# Altium schematic sheet 200_AUX_SUPPLIES.SchDoc
size A3; SheetNumber: 3; SheetTotal: 5
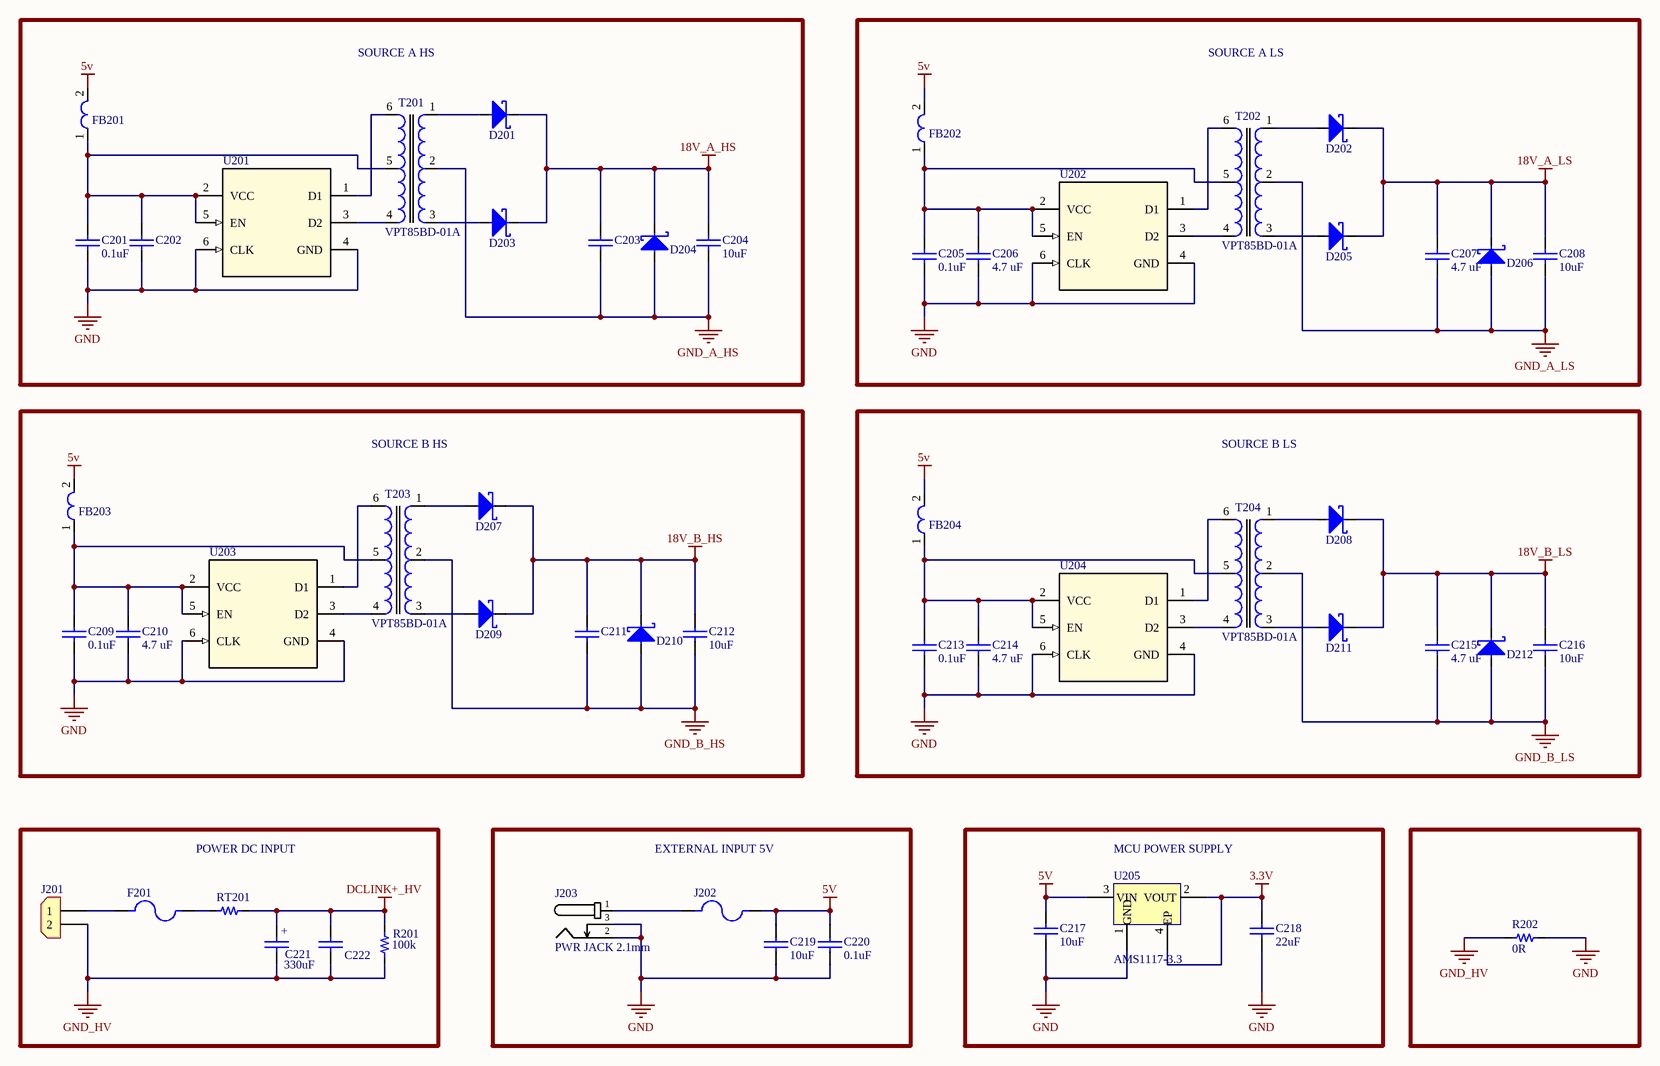
[diagram p0: 200_AUX_SUPPLIES.SchDoc]

## Parts
C201  value 0.1uF  [0603_cap]
C202  (no value)  [0603_cap]
C203  (no value)  [0603_cap]
C204  value 10uF  [0805_cap]
C205  value 0.1uF  [0603_cap]
C206  4.7 uF  [0603_cap]
C207  4.7 uF  [0603_cap]
C208  value 10uF  [0805_cap]
C209  value 0.1uF  [0603_cap]
C210  4.7 uF  [0603_cap]
C211  (no value)  [0603_cap]
C212  value 10uF  [0805_cap]
C213  value 0.1uF  [0603_cap]
C214  4.7 uF  [0603_cap]
C215  4.7 uF  [0603_cap]
C216  value 10uF  [0805_cap]
C217  value 10uF  [0603_cap]  (hidden comment: 10uF 10V)
C218  value 22uF  [0603_cap]  (hidden comment: 22uF 10V)
C219  value 10uF  [0805_cap]  (hidden comment: 10uF 25V)
C220  0.1uF  [0603_cap]
C221  value 330uF  [CAP_MXC_22x30_RUB]
C222  (no value)  [CAP_M26.5X8.5_22.5_1_KEM]
D201  30V 3A  [SMA]  (value not drawn)
D202  30V 3A  [SMA]  (value not drawn)
D203  30V 3A  [SMA]  (value not drawn)
D204  Diodo - Zener 20 V  [SOD-123_ONS]  (value not drawn)
D205  30V 3A  [SMA]  (value not drawn)
D206  Diodo - Zener 20 V  [SOD-123_ONS]  (value not drawn)
D207  30V 3A  [SMA]  (value not drawn)
D208  30V 3A  [SMA]  (value not drawn)
D209  30V 3A  [SMA]  (value not drawn)
D210  Diodo - Zener 20 V  [SOD-123_ONS]  (value not drawn)
D211  30V 3A  [SMA]  (value not drawn)
D212  Diodo - Zener 20 V  [SOD-123_ONS]  (value not drawn)
F201  (no value)  [FUSE_4628]
FB201  (no value)  [MH1608]
FB202  FERRITE_BEAD_600_OHM  [MH1608]  (value not drawn)
FB203  (no value)  [MH1608]
FB204  (no value)  [MH1608]
J201  (no value)  [CON_2x1_TH_5MM]
J202  FUSE HLDR CARTRIDGE 250V 5A PCB  [FUSE_4628]  (value not drawn)
J203  PWR JACK 2.1mm  [CON_POWER_BARREL_2.1MM_3CONN]
R201  value 100k  [YAG_FMP200_YAG]
R202  value 0R  [0603_res]  (hidden comment: 0R 1/10W)
RT201  (no value)  [RES_37S509M_TDK]
T201  Manufacturer Part Number: VPT85BD-01A  [PAD002-T764113S]  (hidden comment: TRANSFORMER_SMPS_XFMR_FWD)
T202  Manufacturer Part Number: VPT85BD-01A  [PAD002-T764113S]  (hidden comment: TRANSFORMER_SMPS_XFMR_FWD)
T203  Manufacturer Part Number: VPT85BD-01A  [PAD002-T764113S]  (hidden comment: TRANSFORMER_SMPS_XFMR_FWD)
T204  Manufacturer Part Number: VPT85BD-01A  [PAD002-T764113S]  (hidden comment: TRANSFORMER_SMPS_XFMR_FWD)
U201  (no value)  [IC TRANSFORMER DRIVER 6SOT-23]
U202  (no value)  [IC TRANSFORMER DRIVER 6SOT-23]
U203  (no value)  [IC TRANSFORMER DRIVER 6SOT-23]
U204  (no value)  [IC TRANSFORMER DRIVER 6SOT-23]
U205  AMS1117-3.3  [SOT_223]

## Blocks framed on the sheet
SOURCE A HS: C201-C204 D201 D203 D204 FB201 T201 U201
SOURCE A LS: C205-C208 D202 D205 D206 FB202 T202 U202
SOURCE B HS: C209-C212 D207 D209 D210 FB203 T203 U203
SOURCE B LS: C213-C216 D208 D211 D212 FB204 T204 U204
POWER DC INPUT: C221 C222 F201 J201 R201 RT201
EXTERNAL INPUT 5V: C219 C220 J202 J203
MCU POWER SUPPLY: C217 C218 U205

## Nets
3.3V: C218.1 U205.2(VOUT) U205.4(EP)
5v: C217.1 C219.1 C220.1 FB201.2 FB202.2 FB203.2 FB204.2 J202.2 U205.3(VIN)
18V_A_HS: C203.1 C204.1 D201.1 D203.1 D204.1
18V_A_LS: C207.1 C208.1 D202.1 D205.1 D206.1
18V_B_HS: C211.1 C212.1 D207.1 D209.1 D210.1
18V_B_LS: C215.1 C216.1 D208.1 D211.1 D212.1
DCLINK+_HV: C221.1 C222.1 R201.2 RT201.2
GND: C201.2 C202.2 C205.2 C206.2 C209.2 C210.2 C213.2 C214.2 C217.2 C218.2 C219.2 C220.2 J203.2 J203.3 R202.2 U201.4(GND) U201.6(CLK) U202.4(GND) U202.6(CLK) U203.4(GND) U203.6(CLK) U204.4(GND) U204.6(CLK) U205.1(GND)
GND_A_HS: C203.2 C204.2 D204.2 T201.2
GND_A_LS: C207.2 C208.2 D206.2 T202.2
GND_B_HS: C211.2 C212.2 D210.2 T203.2
GND_B_LS: C215.2 C216.2 D212.2 T204.2
GND_HV: C221.2 C222.2 J201.2 R201.1 R202.1
NetC201_1: C201.1 C202.1 FB201.1 T201.5 U201.2(VCC) U201.5(EN)
NetC205_1: C205.1 C206.1 FB202.1 T202.5 U202.2(VCC) U202.5(EN)
NetC209_1: C209.1 C210.1 FB203.1 T203.5 U203.2(VCC) U203.5(EN)
NetC213_1: C213.1 C214.1 FB204.1 T204.5 U204.2(VCC) U204.5(EN)
NetD201_2: D201.2 T201.1
NetD202_2: D202.2 T202.1
NetD203_2: D203.2 T201.3
NetD205_2: D205.2 T202.3
NetD207_2: D207.2 T203.1
NetD208_2: D208.2 T204.1
NetD209_2: D209.2 T203.3
NetD211_2: D211.2 T204.3
NetF201_1: F201.1 J201.1
NetF201_2: F201.2 RT201.1
NetJ202_1: J202.1 J203.1
NetT201_4: T201.4 U201.3(D2)
NetT201_6: T201.6 U201.1(D1)
NetT202_4: T202.4 U202.3(D2)
NetT202_6: T202.6 U202.1(D1)
NetT203_4: T203.4 U203.3(D2)
NetT203_6: T203.6 U203.1(D1)
NetT204_4: T204.4 U204.3(D2)
NetT204_6: T204.6 U204.1(D1)

## Notes on the sheet
- (in symbol CAP_ALUM_330UF_250V) +

## Library data of the parts
C201 C205 C209 C213 = Cap_0.1uF_0603_50V: 50V 100nF Y5V -20%~+80% 0603 Multilayer Ceramic Capacitors MLCC - SMD/SMT ROHS; Manufacturer: Walsin Tech Corp; Manufacturer Part Number: 0603F104Z500CT; Supplier 1: LCSC; Supplier Part Number 1: C83060; ComponentLink1Description: LCSC; ComponentLink1URL: https://www.lcsc.com/product-detail/Multilayer-Ceramic-Capacitors-MLCC-SMD-SMT_Walsin-Tech-Corp-0603F104Z500CT_C83060.html
C202 C203 C206 C207 C210 C211 C214 C215 = CAP_4.7UF_25V_0603: CAP CER 4.7uF 25V X5R 0603; Manufacturer: muRata; Manufacturer Part Number: GRM188R61E475KE11D; ComponentLink1Description: LCSC; ComponentLink1URL: https://www.lcsc.com/product-detail/C90057.html?s_z=n_q_GRM188R61E475KE11D&spm=wm.fly.bg.0.stp&lcsc_vid=RQNdVwAEE1JbUldTTgAIXlFWQ1NYXlYETgNXUlBVFQMxVlNRTlVXX11TRlZZXjsOAxUeFF5JWBYZEEoKFBINSQcJGk4%3D; Supplier 1: LCSC; Supplier Part Number 1: C90057
C204 C208 C212 C216 C219 = Cap_10uF_0805_25V_: 25V 10uF X5R ±10% 0805 Multilayer Ceramic Capacitors MLCC - SMD/SMT ROHS; Manufacturer: Samsung Electro-Mechanics; Manufacturer Part Number: CL21A106KAYNNNE; Supplier 1: LCSC; Supplier Part Number 1: C15850; ComponentLink1Description: LCSC; ComponentLink1URL: https://lcsc.com/product-detail/Multilayer-Ceramic-Capacitors-MLCC-SMD-SMT_Samsung-Electro-Mechanics-CL21A106KAYNNNE_C15850.html
C217 = Cap_10uF_0603_10V: 10V 10uF X5R ±10% 0603 Multilayer Ceramic Capacitors MLCC - SMD/SMT ROHS; Manufacturer: CCTC; Manufacturer Part Number: TCC0603X5R106K100CT; Supplier 1: LCSC; Supplier Part Number 1: C380314; ComponentLink1Description: LCSC; ComponentLink1URL: https://www.lcsc.com/product-detail/Multilayer-Ceramic-Capacitors-MLCC-SMD-SMT_CCTC-TCC0603X5R106K100CT_C380314.html
C218 = Cap_22uF_0603_10V: 10V 22uF X5R ±20% 0603 Multilayer Ceramic Capacitors MLCC - SMD/SMT ROHS; Manufacturer: HRE; Manufacturer Part Number: CGA0603X5R226M100JT; Supplier 1: LCSC; Supplier Part Number 1: C6119863; ComponentLink1Description: LCSC; ComponentLink1URL: https://lcsc.com/product-detail/Multilayer-Ceramic-Capacitors-MLCC-SMD-SMT_HRE-CGA0603X5R226M100JT_C6119863.html
C220 = Cap_0.1uF_0603_50V: CAP CER 100nF 50V Y5V 0603; Manufacturer: FOJAN; Manufacturer Part Number: FCC0603F104Z500CT; Supplier 1: LCSC; Supplier Part Number 1: C5137469; ComponentLink1Description: LCSC; ComponentLink1URL: https://www.lcsc.com/product-detail/C5137469.html?s_z=n_q_0603F104Z500CT&spm=wm.fly.bg.2.xh&lcsc_vid=Q1QLUFRRTgRfUVdSQAVWUgVQT1JdUlwFE1MMV1EEQgAxVlNRTlhfUFBXRlRXUTsOAxUeFF5JWBYZEEoKFBINSQcJGk4eFQsCAgIaSgADAwAHC0slTldfUldfWQkaCgg%3D; Value: 0.1uF
C221 = CAP_ALUM_330UF_250V: 330 µF 250 V Aluminum Electrolytic Capacitors Radial, Can - Snap-In 3000 Hrs @ 105°C; Manufacturer: Rubycon; Manufacturer Part Number: 250MXG330MEFCSN22X30; Supplier 1: LCSC; Supplier Part Number 1: C239294; ComponentLink1Description: LCSC; ComponentLink1URL: https://www.lcsc.com/product-detail/C239294.html?s_z=n_q_250MXG330MEFCSN22X30
C222 = CAP FILM 1UF 10% 400VDC RADIAL: 1 µF Film Capacitor 200V 400V Polyester, Polyethylene Terephthalate (PET), Metallized Radial; Manufacturer: KEMET; Manufacturer Part Number: R60MN4100AA40K; Supplier 1: LCSC; Supplier Part Number 1: C3775208; ComponentLink1Description: LCSC; ComponentLink1URL: https://www.lcsc.com/product-detail/C3775208.html?s_z=n_q_R60MN4100AA40K&spm=wm.fly.bg.0.xh&lcsc_vid=Q1QLUFRRTgRfUVdSQAVWUgVQT1JdUlwFE1MMV1EEQgAxVlNRTlZbUlJXT1VWXjsOAxUeFF5JWBYZEEoKFBINSQcJGk4eFQsCAgIaSgADAwAHC0slRVhXUFVQR08GEwkK
D201-D203 D205 D207-D209 D211 = D_Schottky_40V_3A_SMA: 40V Independent 3A 550mV@3A SMA Schottky Diodes ROHS; Manufacturer: TDSEMIC; Manufacturer Part Number: SS34-TD; Supplier 1: LCSC; Supplier Part Number 1: C46550832; ComponentLink1Description: LCSC; ComponentLink1URL: https://lcsc.com/product-detail/Schottky-Diodes_TDSEMIC-SS34-TD_C46550832.html
D204 D206 D210 D212 = Diodo - Zener 20 V: -55℃~+150℃ 1 Independent 100nA@15V 19V~21V 20V 25Ω 500mW 600Ω SOD-123 Zener Diodes ROHS; Manufacturer: Slkor(SLKORMICRO Elec.); Manufacturer Part Number: MMSZ5250B; Supplier 1: JLCPCB; Supplier Part Number 1: C707177; ComponentLink1Description: JLCPCB; ComponentLink1URL: https://jlcpcb.com/partdetail/Slkor_SLKORMICRO_Elec-MMSZ5250B/C707177
F201 J202 = FUSE HLDR CARTRIDGE 250V 5A PCB: Fuse Holder 5 A 250V 1 Circuit Cartridge Through Hole; Manufacturer: Keystone; Manufacturer Part Number: 4628; Supplier 1: LCSC; Supplier Part Number 1: C3205254; ComponentLink1Description: LCSC; ComponentLink1URL: https://www.lcsc.com/product-detail/C3205254.html?s_z=n_q_x_Keystone%25204628&spm=wm.ssy.em.0.tz&lcsc_vid=Q1QLUFRRTgRfUVdSQAVWUgVQT1JdUlwFE1MMV1EEQgAxVlNRTlZbVlFQQVlcXzsOAxUeFF5JWBYZEEoKFBINSQcJGk4eFQsCAgIaSgADAwAHC0slQ1hXVFRQQU8GEwkK
FB201-FB204 = FERRITE_BEAD_600_OHM: FERRITE BEAD 600 OHM 0603 4LN; Manufacturer: Bourns Inc.; Manufacturer Part Number: MH1608-601Y; ComponentLink1Description: DigiKEy; ComponentLink1URL: https://www.digikey.com/en/products/detail/bourns-inc/MH1608-601Y/2563317; Supplier 1: DigiKey; Supplier Part Number 1: MH1608-601YCT-ND
J201 = Con_2x1_TH_5mm: 2POS 5MM; Manufacturer: JILN; Manufacturer Part Number: JL126-50002G01; Supplier 1: LCSC; Supplier Part Number 1: C394556; ComponentLink1Description: Digi-Key; ComponentLink1URL: https://www.lcsc.com/product-detail/Screw-terminal_JILN-JL126-50002G01_C394556.html
J203 = Con_Power_Jack_2.1mm_3pins: CONN PWR JACK 2X5.5MM SOLDER; Manufacturer: HCTL; Manufacturer Part Number: HC-DC-005-2.0T; Supplier 1: LCSC; Supplier Part Number 1: C3010533; ComponentLink1Description: LCSC; ComponentLink1URL: https://www.lcsc.com/product-detail/AC-DC-Power-Connectors_HCTL-HC-DC-005-2-0T_C3010533.html
R201 = RES 100K OHM 5% 2W AXIAL: 100 kOhms ±5% 2W Through Hole Resistor Axial Flame Proof, Safety Metal Film; Manufacturer: YAGEO; Manufacturer Part Number: FMP200JR-52-100K; ComponentLink1URL: https://www.lcsc.com/product-detail/C3456483.html?s_z=n_q_FMP200JR-52-100K&spm=wm.fly.bg.0.xh&lcsc_vid=Q1QLUFRRTgRfUVdSQAVWUgVQT1JdUlwFE1MMV1EEQgAxVlNRTlZbUVVUQFBeVjsOAxUeFF5JWBYZEEoKFBINSQcJGk4eFQsCAgIaSgADAwAHC0slRFZZUlZWT08GEwkK; Supplier 1: LCSC; Supplier Part Number 1: C3456483; ComponentLink1Description: LCSC
R202 = Res_0R_0603_1/10W: RES SMD 0R OHM 5% 1/10W 0603; Manufacturer: FOJAN; Manufacturer Part Number: FRC0603P000 TS; ComponentLink1URL: https://www.lcsc.com/product-detail/Chip-Resistor-Surface-Mount_FOJAN-FRC0603P000-TS_C2907080.html; Supplier 1: LCSC; Supplier Part Number 1: C2907080; ComponentLink1Description: LCSC
RT201 = ICL_5_OHM_5A: Inrush Current Limiter 5 Ohms ±20% 5 A 0.591" (15.00mm); Manufacturer: TDK; Manufacturer Part Number: B57237S0509M000; ComponentLink1URL: https://www.lcsc.com/product-detail/C718537.html?s_z=n_q_B57237S0509M000&spm=wm.fly.bg.0.xh&lcsc_vid=FQVeX1BfQFIKVFVWE1NbBlcHQlcKVgFUQwMPAQZWElcxVlNRTlldUVVTT1FbVjsOAxUeFF5JWBYZEEoKFBINSQcJGk4eFQsCAgIaSgADAwAHC0slRFVbUVBeRE8GEwkK; Supplier 1: LCSC; Supplier Part Number 1: C718537; ComponentLink1Description: LCSC
T201-T204 = TRANSFORMER_SMPS_XFMR_FWD: XFMR FWD P-P DC/DC CONV 475UH SM; Manufacturer: VPSC; ComponentLink1Description: LCSC; ComponentLink1URL: https://www.lcsc.com/product-detail/C2846911.html; Supplier 1: LCSC; Supplier Part Number 1: C2846911
U201-U204 = IC_TRANSFORMER_DRIVER_6SOT-23: IC TRANSFORMER DRIVER 6SOT-23; Manufacturer Part Number: SN6505BDBVR; Manufacturer: Texas Instruments; ComponentLink1Description: LCSC; ComponentLink1URL: https://www.lcsc.com/product-detail/C74518.html?s_z=n_q_SN6505BDBVR&spm=wm.fly.bg.0.xh&lcsc_vid=RQNdVwAEE1JbUldTTgAIXlFWQ1NYXlYETgNXUlBVFQMxVlNRTlReV1VfRFJbUjsOAxUeFF5JWBYZEEoKFBINSQcJGk4eFQsCAgIaSgADAwAHC0slTlFeUlNIHxUDCw%3D%3D; Supplier 1: LCSC; Supplier Part Number 1: C74518
U205 = LDO_3V3_1A_FIXED: 1A 60dB@(120Hz) Fixed 3.3V Positive 18V SOT-223 Linear Voltage Regulators (LDO) ROHS; Manufacturer: UMW(Youtai Semiconductor Co., Ltd.); ComponentLink1Description: LCSC; ComponentLink1URL: https://www.lcsc.com/product-detail/_UMW-Youtai-Semiconductor-Co-Ltd-_C347222.html; Supplier 1: LCSC; Manufacturer Part Number: AMS1117-3.3; Supplier Part Number 1: C347222